# Altium schematic sheet L293D.SchDoc
size A; SheetNumber: 1; SheetTotal: 1
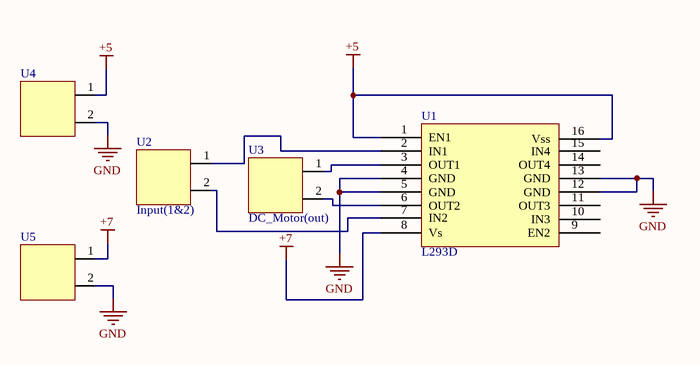
[diagram p0: L293D.SchDoc]

## Parts
U1  L293D  [L293D - duplicate]
U2  Input(1&2)  [Terminal_Block]
U3  DC_Motor(out)  [Terminal_Block]
U4  Terminal_Block  [Terminal_Block]  (value not drawn)
U5  Terminal_Block  [Terminal_Block]  (value not drawn)

## Nets
+5: U1.1(EN1) U1.16(Vss) U4.1
+7: U1.8(Vs) U5.1
GND: U1.4(GND) U1.5(GND) U1.12(GND) U1.13(GND) U4.2 U5.2
NetU1_2: U1.2(IN1) U2.1
NetU1_3: U1.3(OUT1) U3.1
NetU1_6: U1.6(OUT2) U3.2
NetU1_7: U1.7(IN2) U2.2

Not connected (* = marked no-connect by the designer): U1 9(EN2) 10(IN3) 11(OUT3) 14(OUT4) 15(IN4)

## Library data of the parts
U1 = L293D_IC: Manufacturer: Texas Instrument; Supplier: LCSC
U2 U3 = Terminal_Block